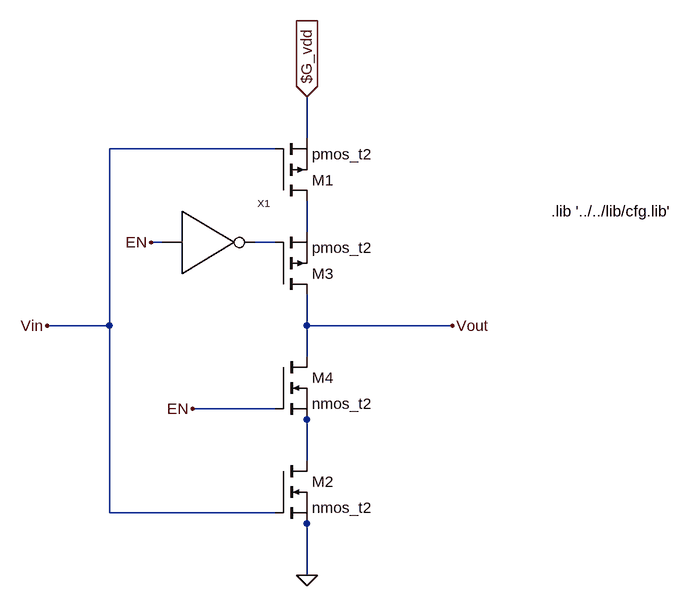
[diagram p0: schematic en_inverter.asc]
en_inverter.asc, the LTspice schematic file:
Version 4
SHEET 1 880 680
WIRE 128 -112 128 -176
WIRE 80 -96 -176 -96
WIRE 128 32 128 -16
WIRE -96 48 -112 48
WIRE 80 48 48 48
WIRE -176 176 -176 -96
WIRE -176 176 -272 176
WIRE 128 176 128 128
WIRE 352 176 128 176
WIRE 128 224 128 176
WIRE 80 304 -48 304
WIRE 128 320 128 304
WIRE 128 384 128 320
WIRE -176 464 -176 176
WIRE 80 464 -176 464
WIRE 128 480 128 464
WIRE 128 560 128 480
FLAG 352 176 Vout
FLAG 128 560 0
FLAG 128 -176 $G_vdd
IOPIN 128 -176 In
FLAG -272 176 Vin
FLAG -112 48 EN
FLAG -48 304 EN
SYMBOL pmos 80 -16 M180
SYMATTR InstName M1
SYMATTR Value pmos_t2
SYMATTR Prefix X
SYMBOL nmos 80 384 R0
SYMATTR InstName M2
SYMATTR Value nmos_t2
SYMATTR Prefix X
SYMBOL pmos 80 128 M180
SYMATTR InstName M3
SYMATTR Value pmos_t2
SYMATTR Prefix X
SYMBOL nmos 80 224 R0
SYMATTR InstName M4
SYMATTR Value nmos_t2
SYMATTR Prefix X
SYMBOL inverter -64 48 R0
SYMATTR InstName X1
TEXT 504 0 Left 2 !.lib '../../lib/cfg.lib'

The netlist it stands for:
* en_inverter.asc
XM1 N001 Vin $G_vdd pmos_t2  ; pins D G S
XM2 N003 Vin 0 nmos_t2  ; pins D G S
XM3 Vout N002 N001 pmos_t2  ; pins D G S
XM4 Vout EN N003 nmos_t2  ; pins D G S
XX1 EN N002 inverter  ; pins Vin Vout
.lib '../../lib/cfg.lib'
.backanno
.end